# EAGLE schematic LCDController (EAGLE 7.3.0)
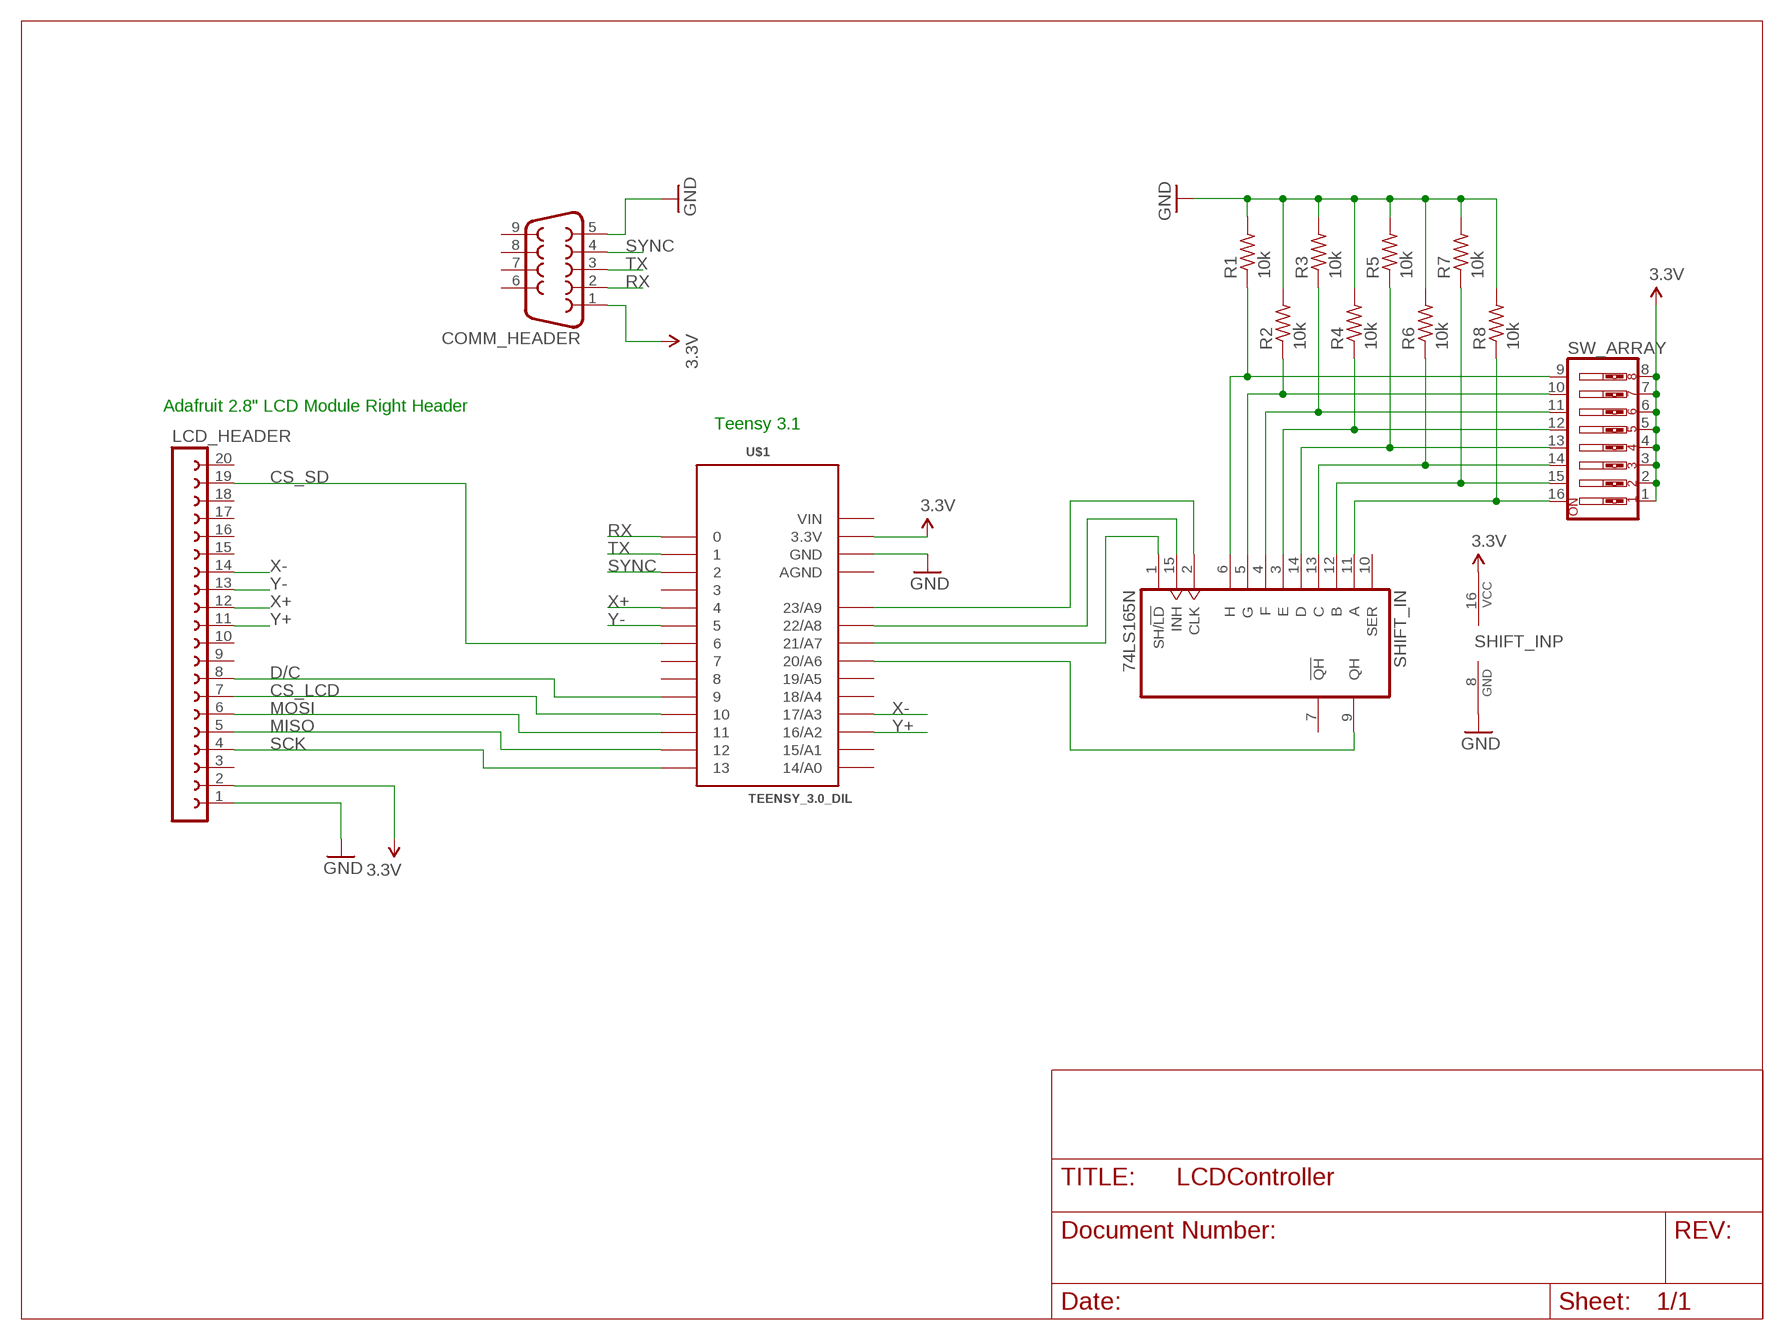
[diagram p0: schematic, sheet 1]

## Parts
COMM_HEADER  F09VB  [F09VB]
LCD_HEADER  FE20-1  [FE20]
R1  10k  R-US_0204/5  [0204/5]
R2  10k  R-US_0204/5  [0204/5]
R3  10k  R-US_0204/5  [0204/5]
R4  10k  R-US_0204/5  [0204/5]
R5  10k  R-US_0204/5  [0204/5]
R6  10k  R-US_0204/5  [0204/5]
R7  10k  R-US_0204/5  [0204/5]
R8  10k  R-US_0204/5  [0204/5]
SHIFT_IN  74LS165N  [DIL16]
SW_ARRAY  SW_DIP-8  [DIPSWITCH-08]
U$1  TEENSY_3.0_DIL  [TEENSY3-DIL]

## Nets
3.3V: COMM_HEADER.1 LCD_HEADER.2 SHIFT_IN.16(VCC) SW_ARRAY.1 SW_ARRAY.2 SW_ARRAY.3 SW_ARRAY.4 SW_ARRAY.5 SW_ARRAY.6 SW_ARRAY.7 SW_ARRAY.8 U$1.3.3V
CS_LCD: LCD_HEADER.7 U$1.10
CS_SD: LCD_HEADER.19 U$1.6
D/C: LCD_HEADER.8 U$1.9
GND: COMM_HEADER.5 LCD_HEADER.1 R1.2 R2.2 R3.2 R4.2 R5.2 R6.2 R7.2 R8.2 SHIFT_IN.8(GND) U$1.GND
MISO: LCD_HEADER.5 U$1.12
MOSI: LCD_HEADER.6 U$1.11
N$1: SHIFT_IN.1(SH/!LD) U$1.21/A7
N$2: SHIFT_IN.9(QH) U$1.20/A6
N$3: SHIFT_IN.15(INH) U$1.22/A8
N$4: R8.1 SHIFT_IN.11(A) SW_ARRAY.16
N$5: R7.1 SHIFT_IN.12(B) SW_ARRAY.15
N$6: R6.1 SHIFT_IN.13(C) SW_ARRAY.14
N$7: R5.1 SHIFT_IN.14(D) SW_ARRAY.13
N$8: R4.1 SHIFT_IN.3(E) SW_ARRAY.12
N$9: R3.1 SHIFT_IN.4(F) SW_ARRAY.11
N$10: R2.1 SHIFT_IN.5(G) SW_ARRAY.10
N$11: R1.1 SHIFT_IN.6(H) SW_ARRAY.9
N$12: SHIFT_IN.2(CLK) U$1.23/A9
RX: COMM_HEADER.2 U$1.0
SCK: LCD_HEADER.4 U$1.13
SYNC: COMM_HEADER.4 U$1.2
TX: COMM_HEADER.3 U$1.1
X+: LCD_HEADER.12 U$1.4
X-: LCD_HEADER.14 U$1.17/A3
Y+: LCD_HEADER.11 U$1.16/A2
Y-: LCD_HEADER.13 U$1.5
Unconnected: COMM_HEADER.6 COMM_HEADER.7 COMM_HEADER.8 COMM_HEADER.9 LCD_HEADER.3 LCD_HEADER.9 LCD_HEADER.10 LCD_HEADER.15 LCD_HEADER.16 LCD_HEADER.17 LCD_HEADER.18 LCD_HEADER.20 SHIFT_IN.7(!QH) SHIFT_IN.10(SER) U$1.3 U$1.7 U$1.8 U$1.14/A0 U$1.15/A1 U$1.18/A4 U$1.19/A5

## Notes on the sheet
- Adafruit 2.8" LCD Module Right Header
- Teensy 3.1

## Power pins joined to a net without a drawn wire
AGND: U$1.AGND
VIN: U$1.VIN

## Library data of the parts
COMM_HEADER = con-subd:F09: SUB-D; OC_FARNELL: unknown; OC_NEWARK: unknown
LCD_HEADER = con-lsta:FE20-1: FEMALE HEADER; OC_FARNELL: unknown; OC_NEWARK: unknown
R1-R8 = rcl:R-US_: RESISTOR, American symbol
SHIFT_IN = 74xx-us:74*165: 8-bit parallel load SHIFT REGISTER
SW_ARRAY = SparkFun-Electromechanical:SW_DIP-8: DIP Switch 8 Position
U$1 = Teensy_3_and_LC_Series_Boards_v1.0:TEENSY_3.0_DIL: TEENSY 3.0 in a classic breadboard layout - pins between the two outer rows.